# EasyEDA Pro project Sch1.epro

# Schematic Schematic1

## Sheets
1 01-POWER
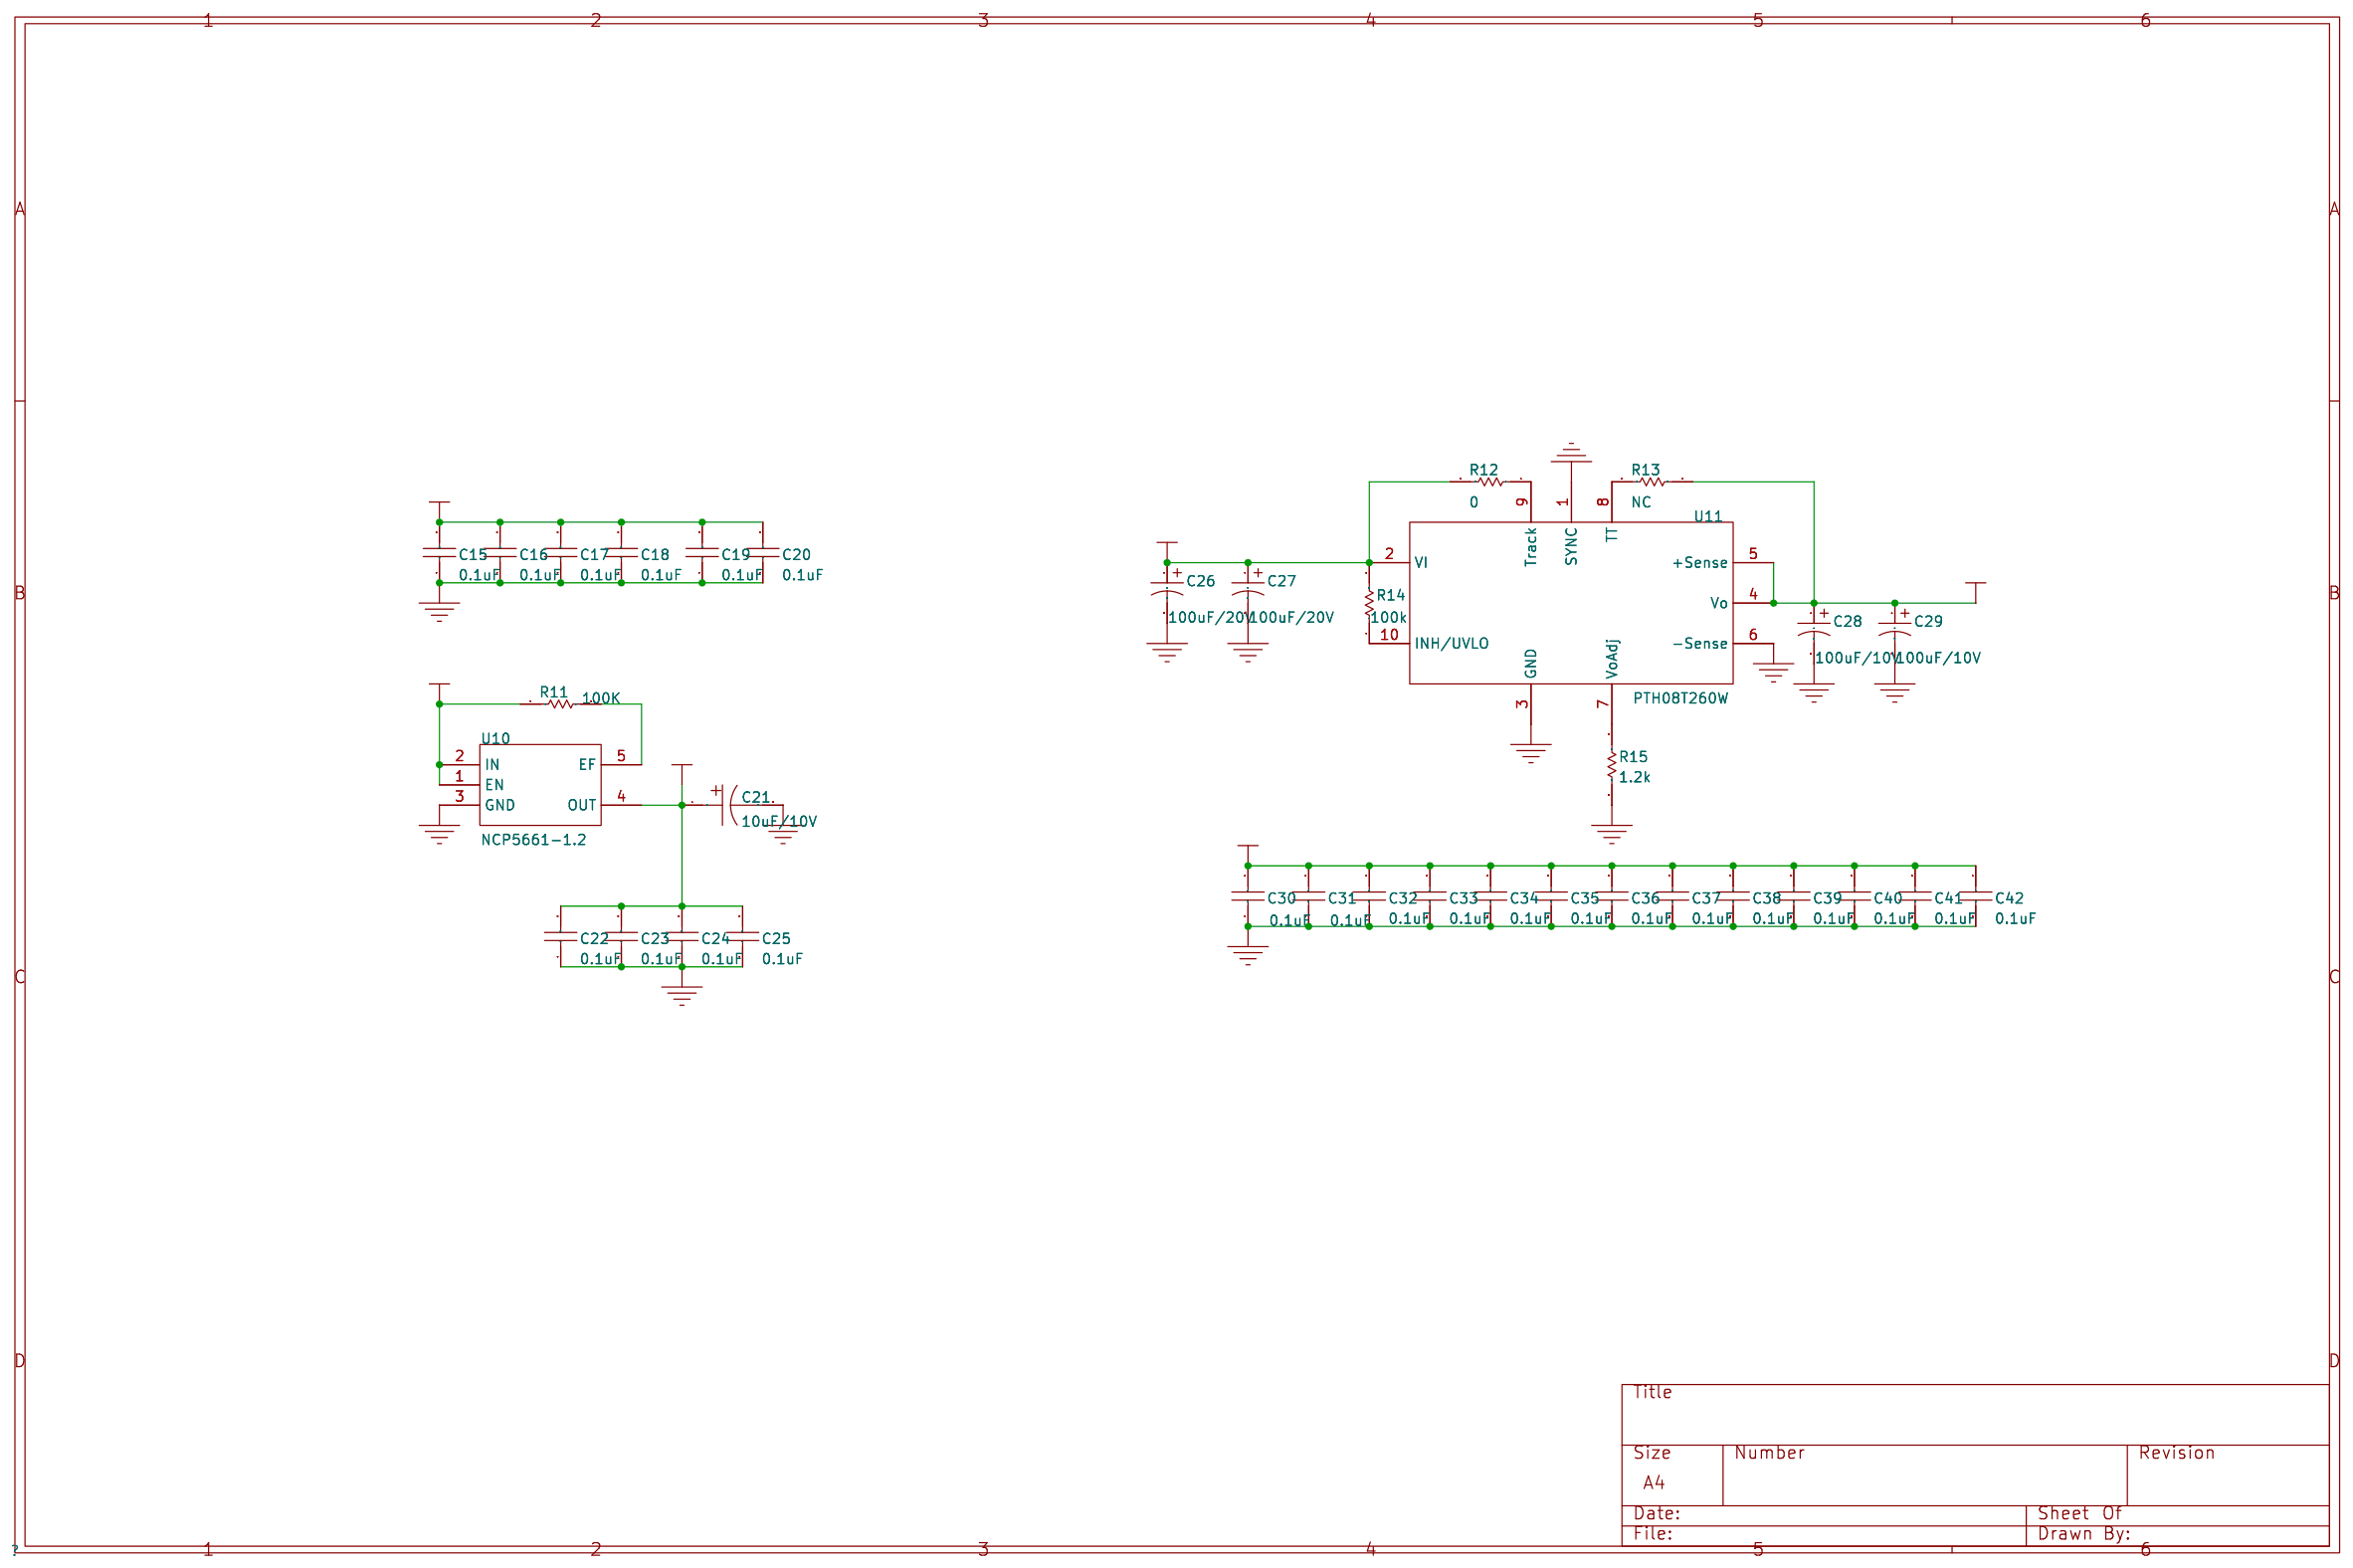
[diagram p0: 01-POWER]
2 02-FPGA
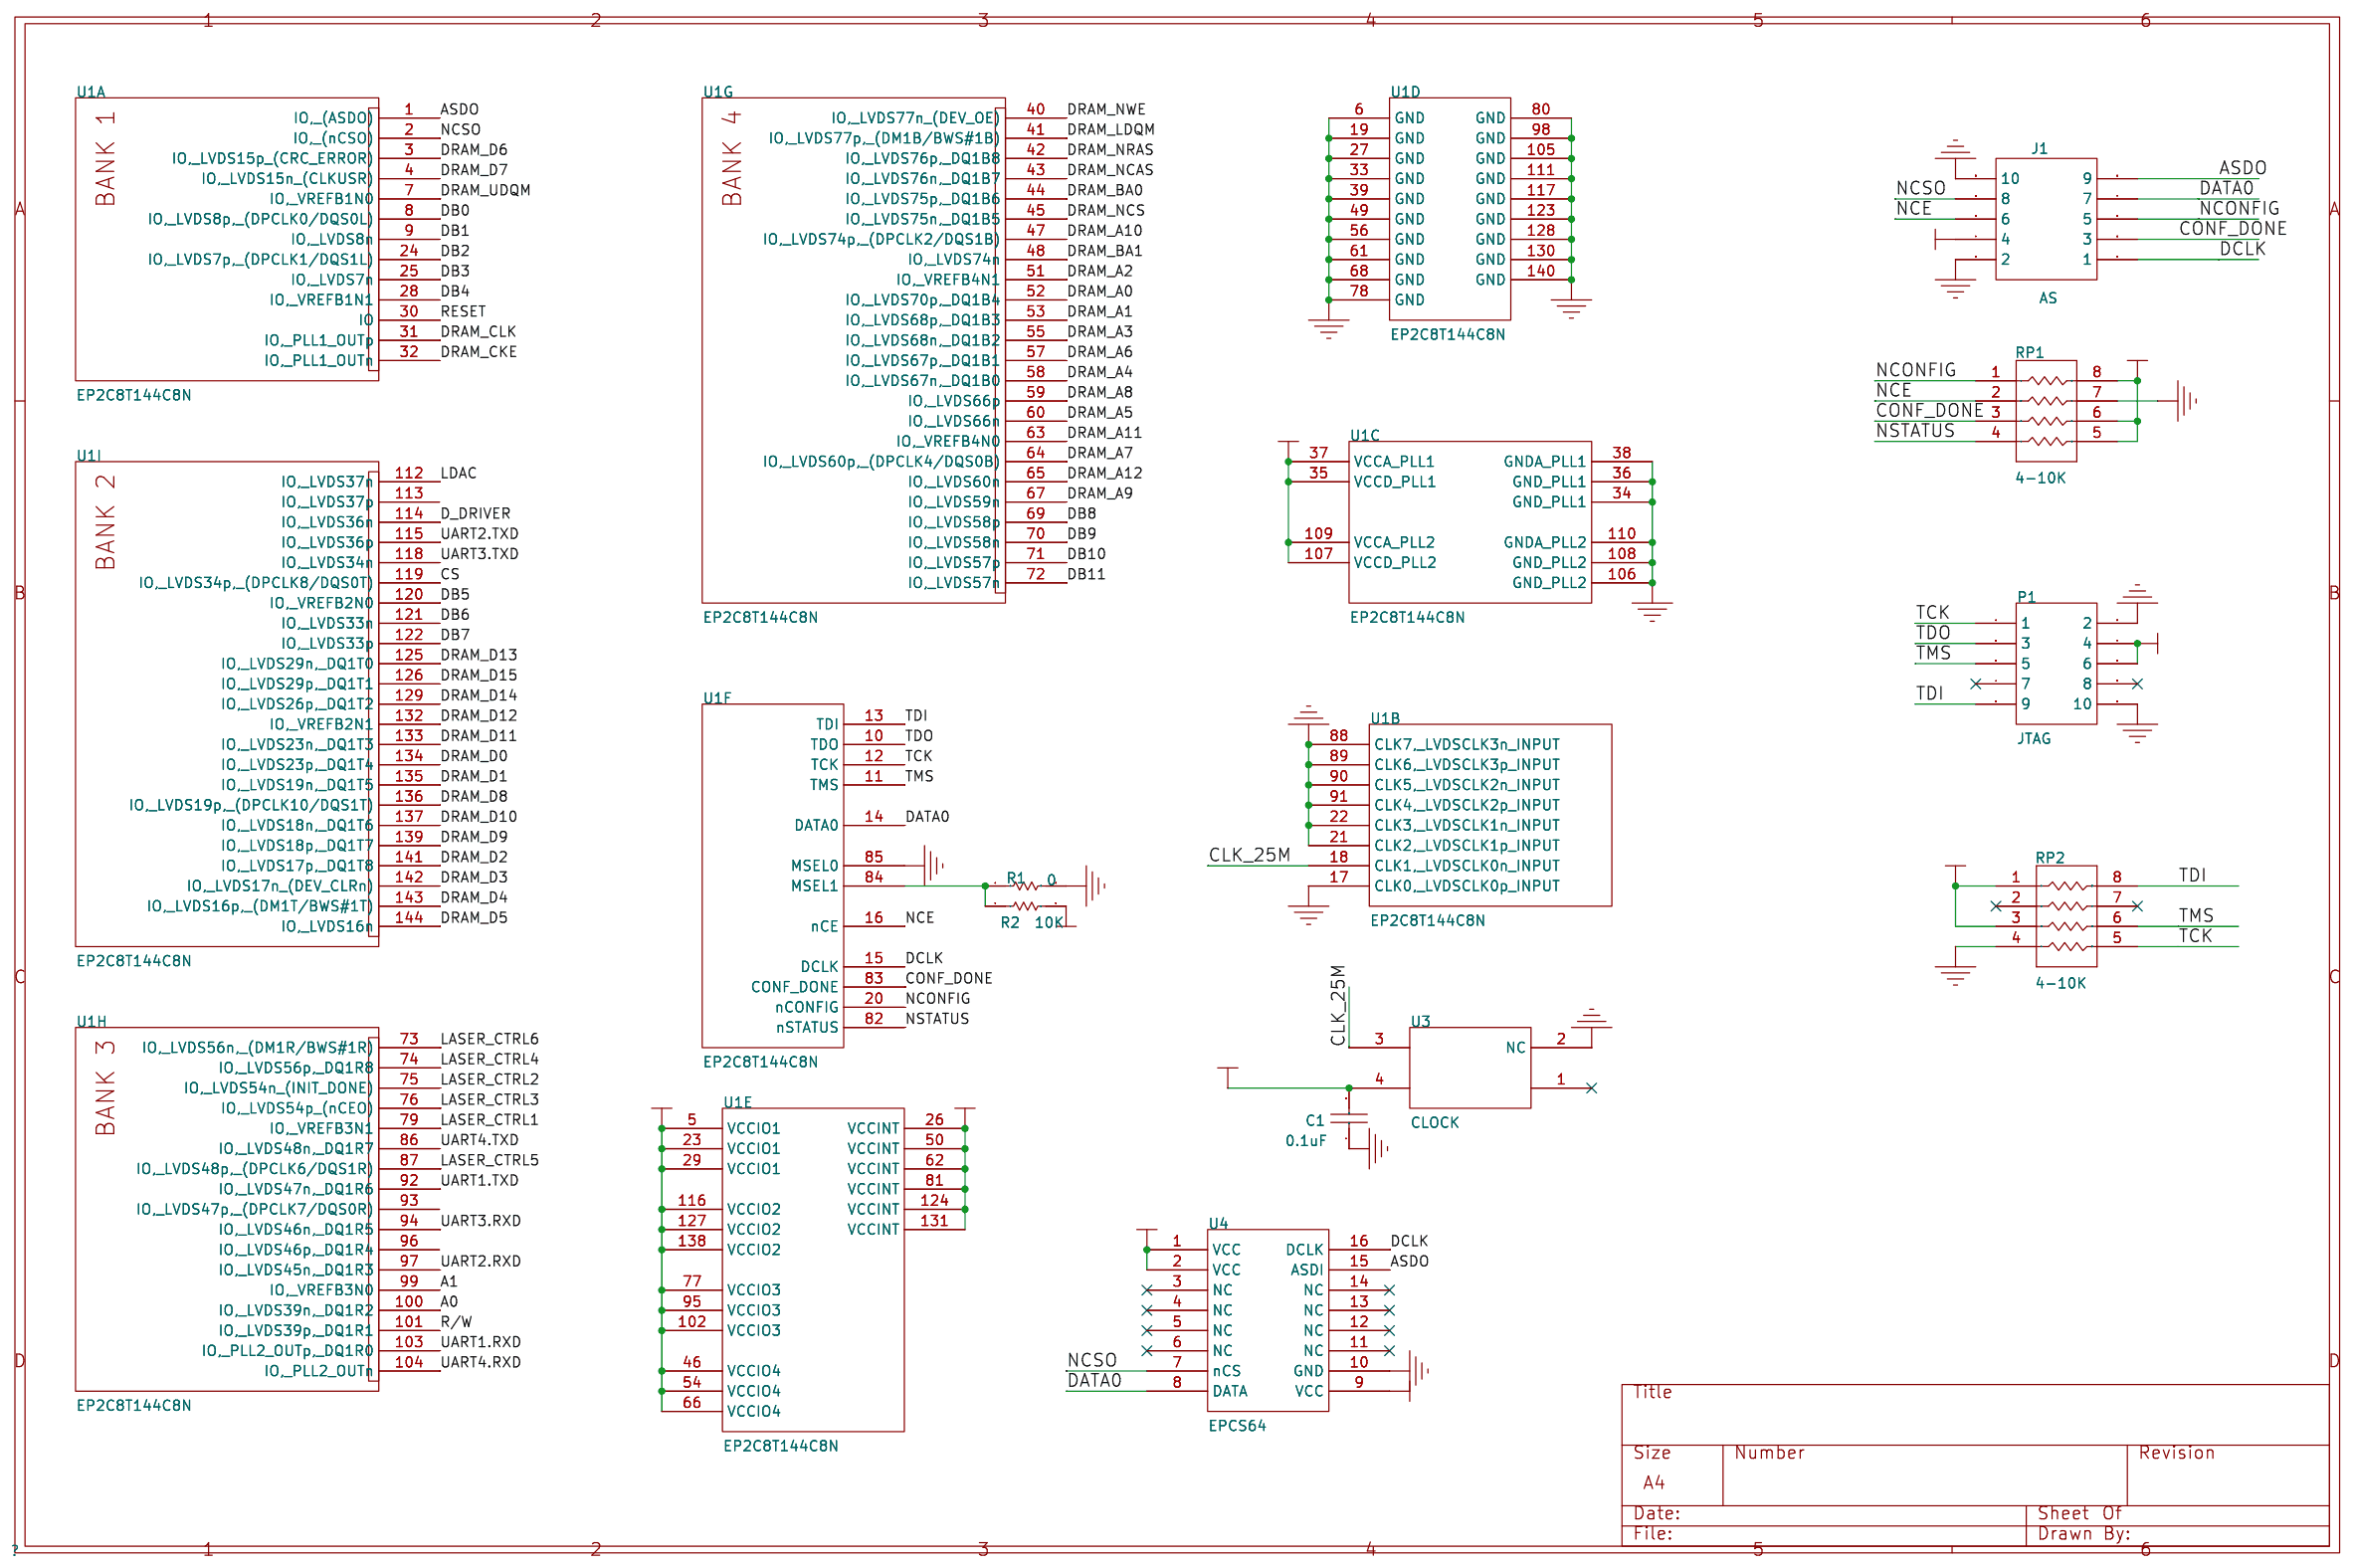
[diagram p1: 02-FPGA]
3 03-MEMORY
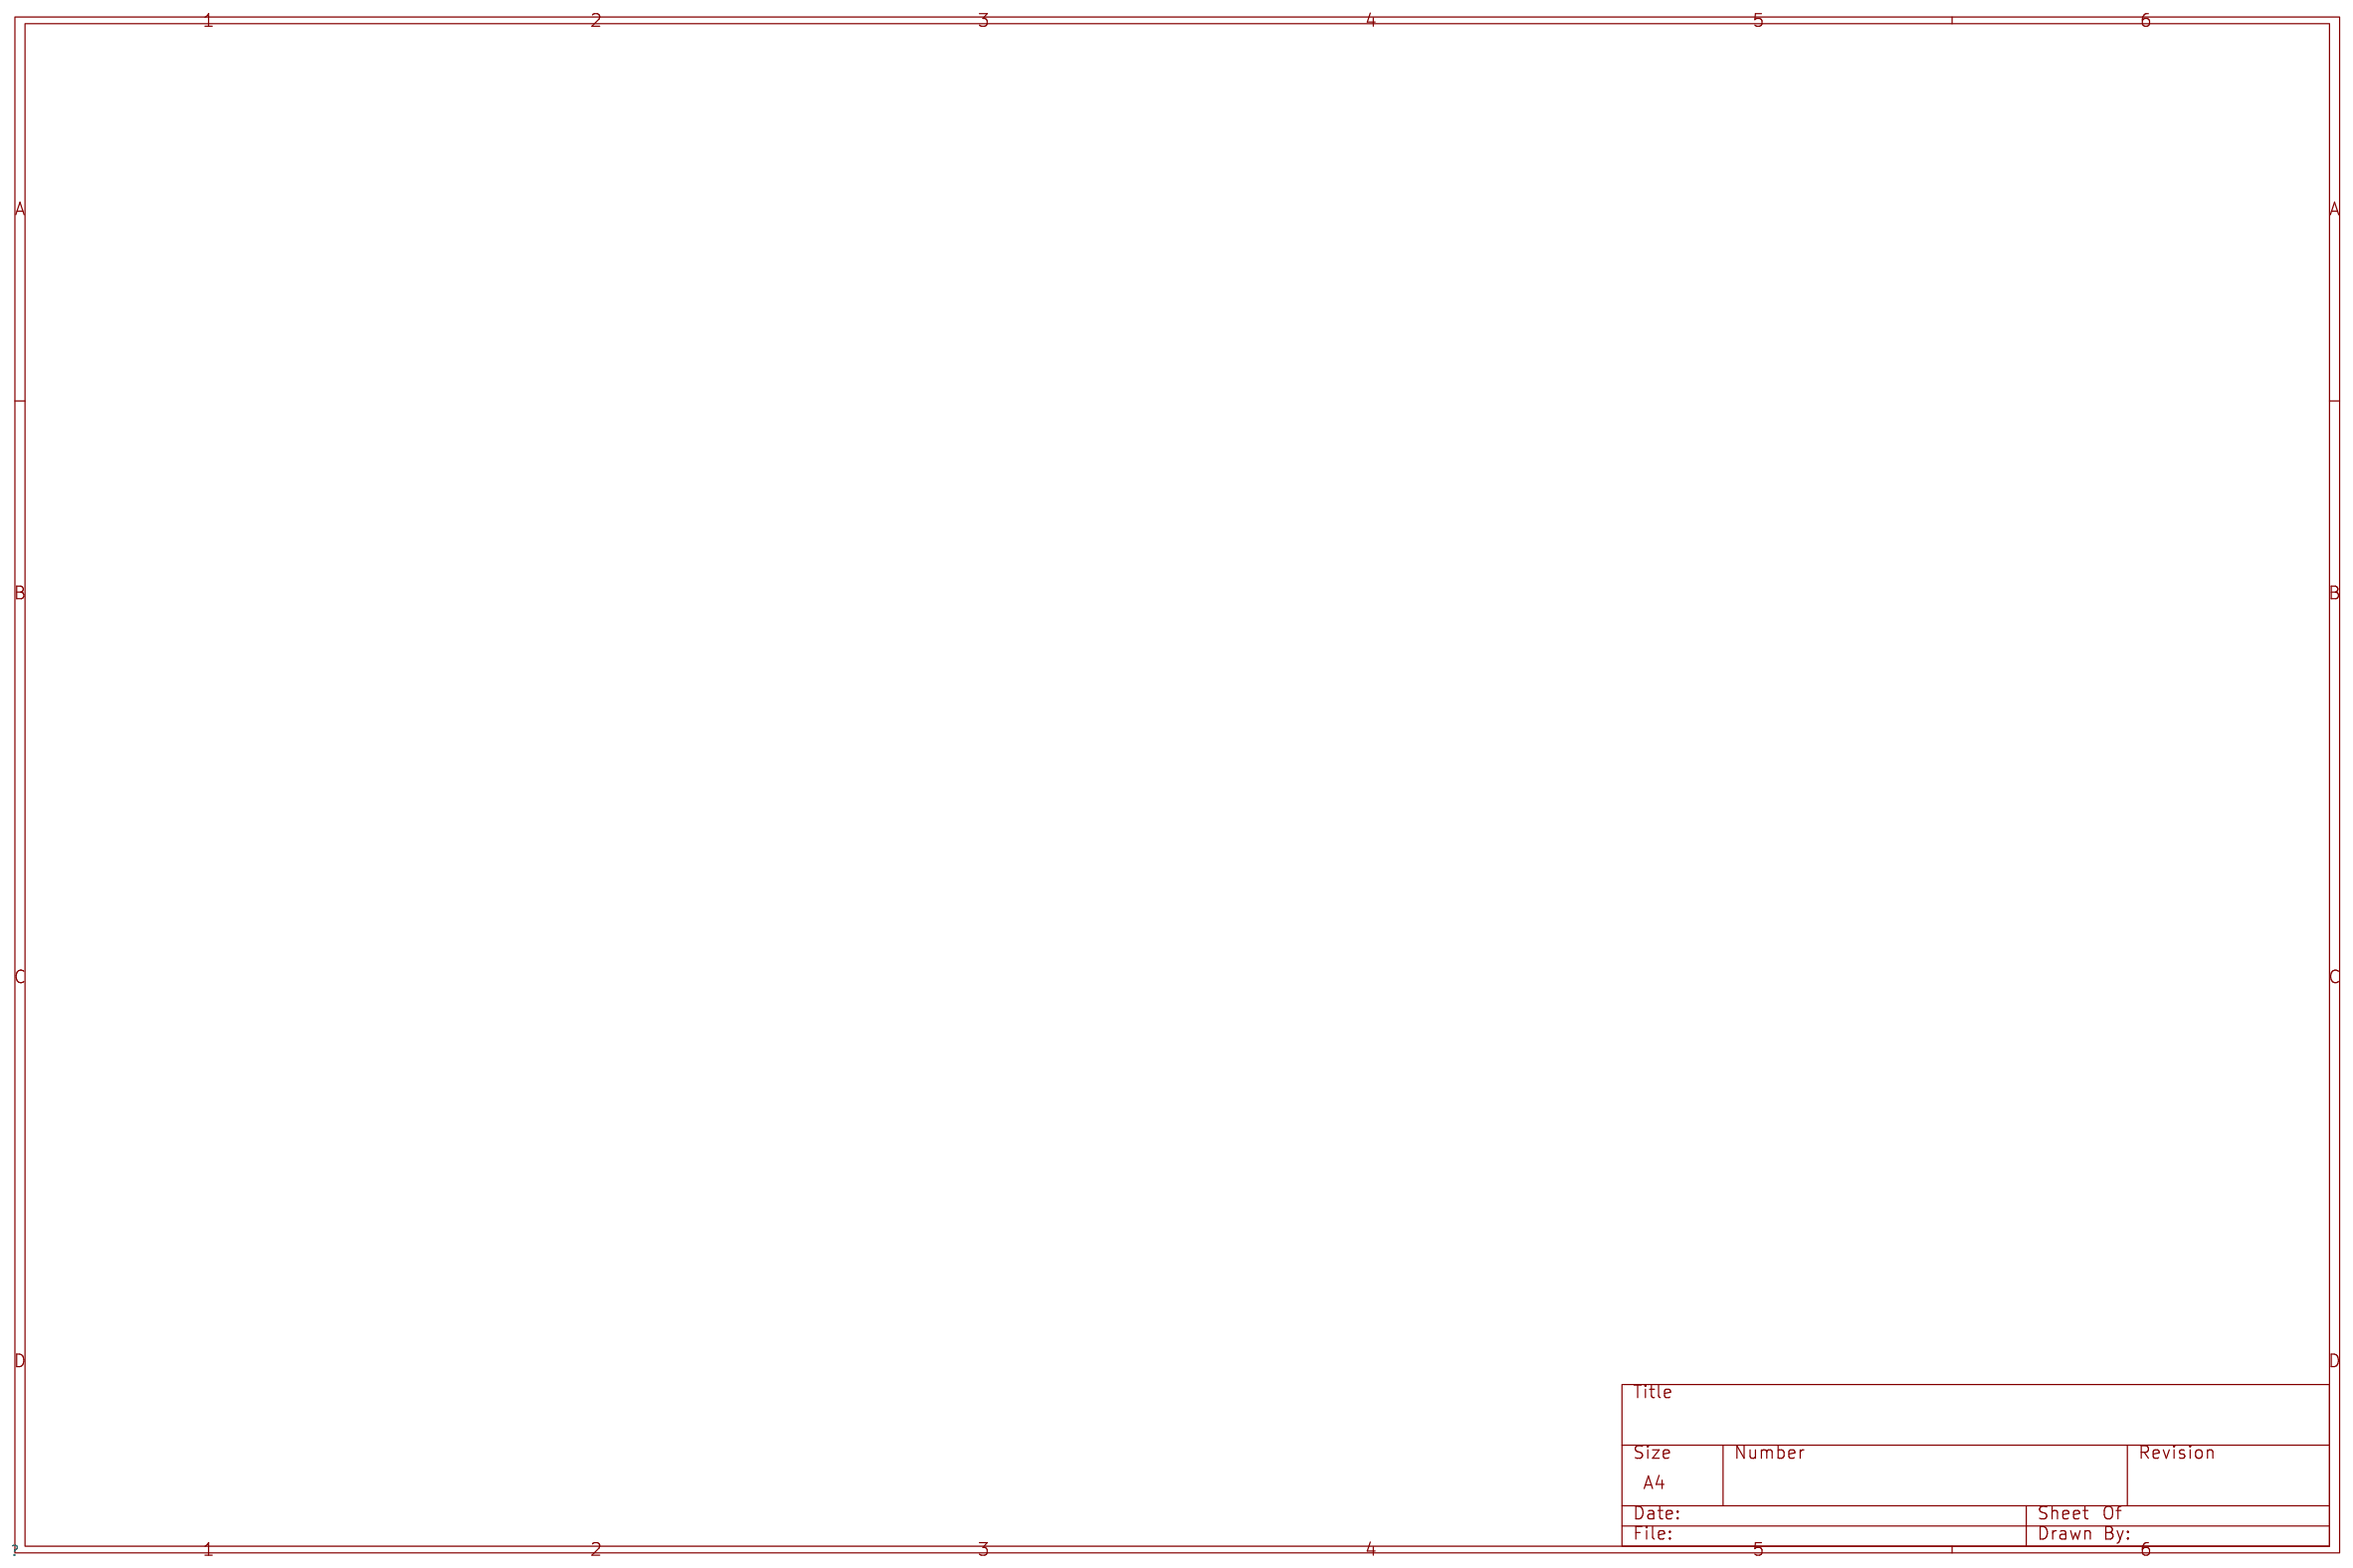
[diagram p2: 03-MEMORY]
4 04-RS422-2
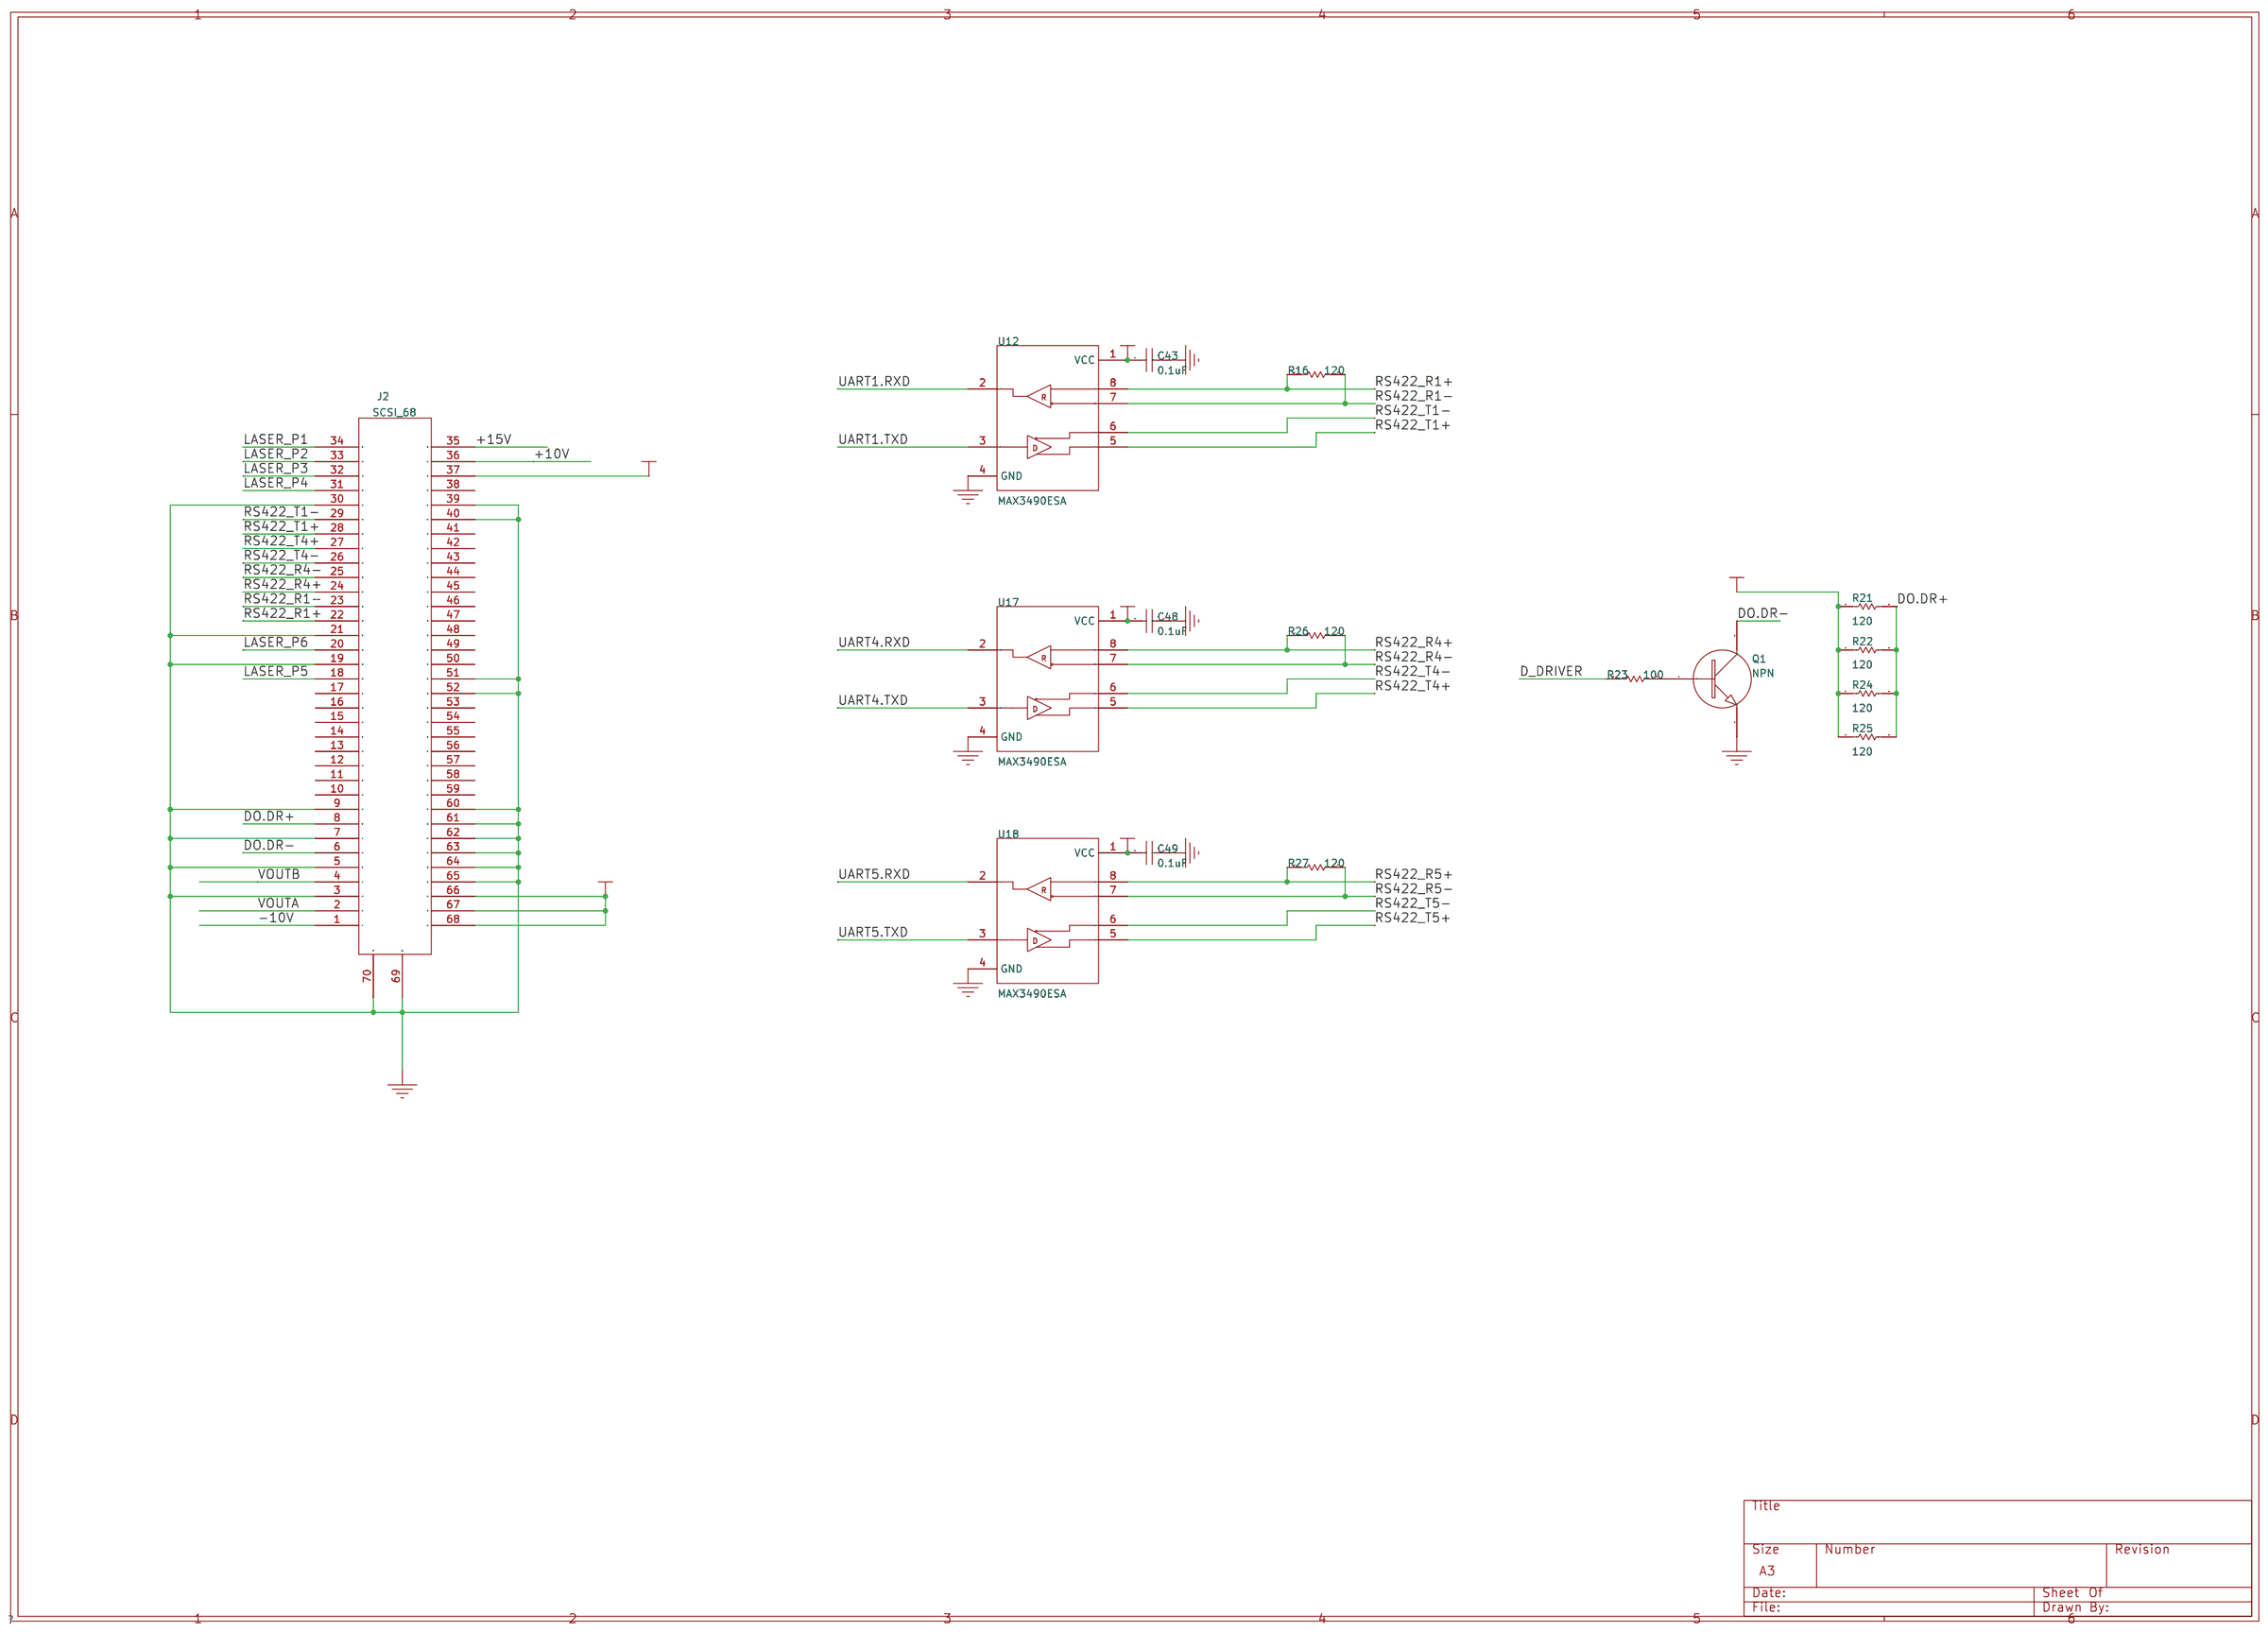
[diagram p3: 04-RS422-2]
5 05-AD8412
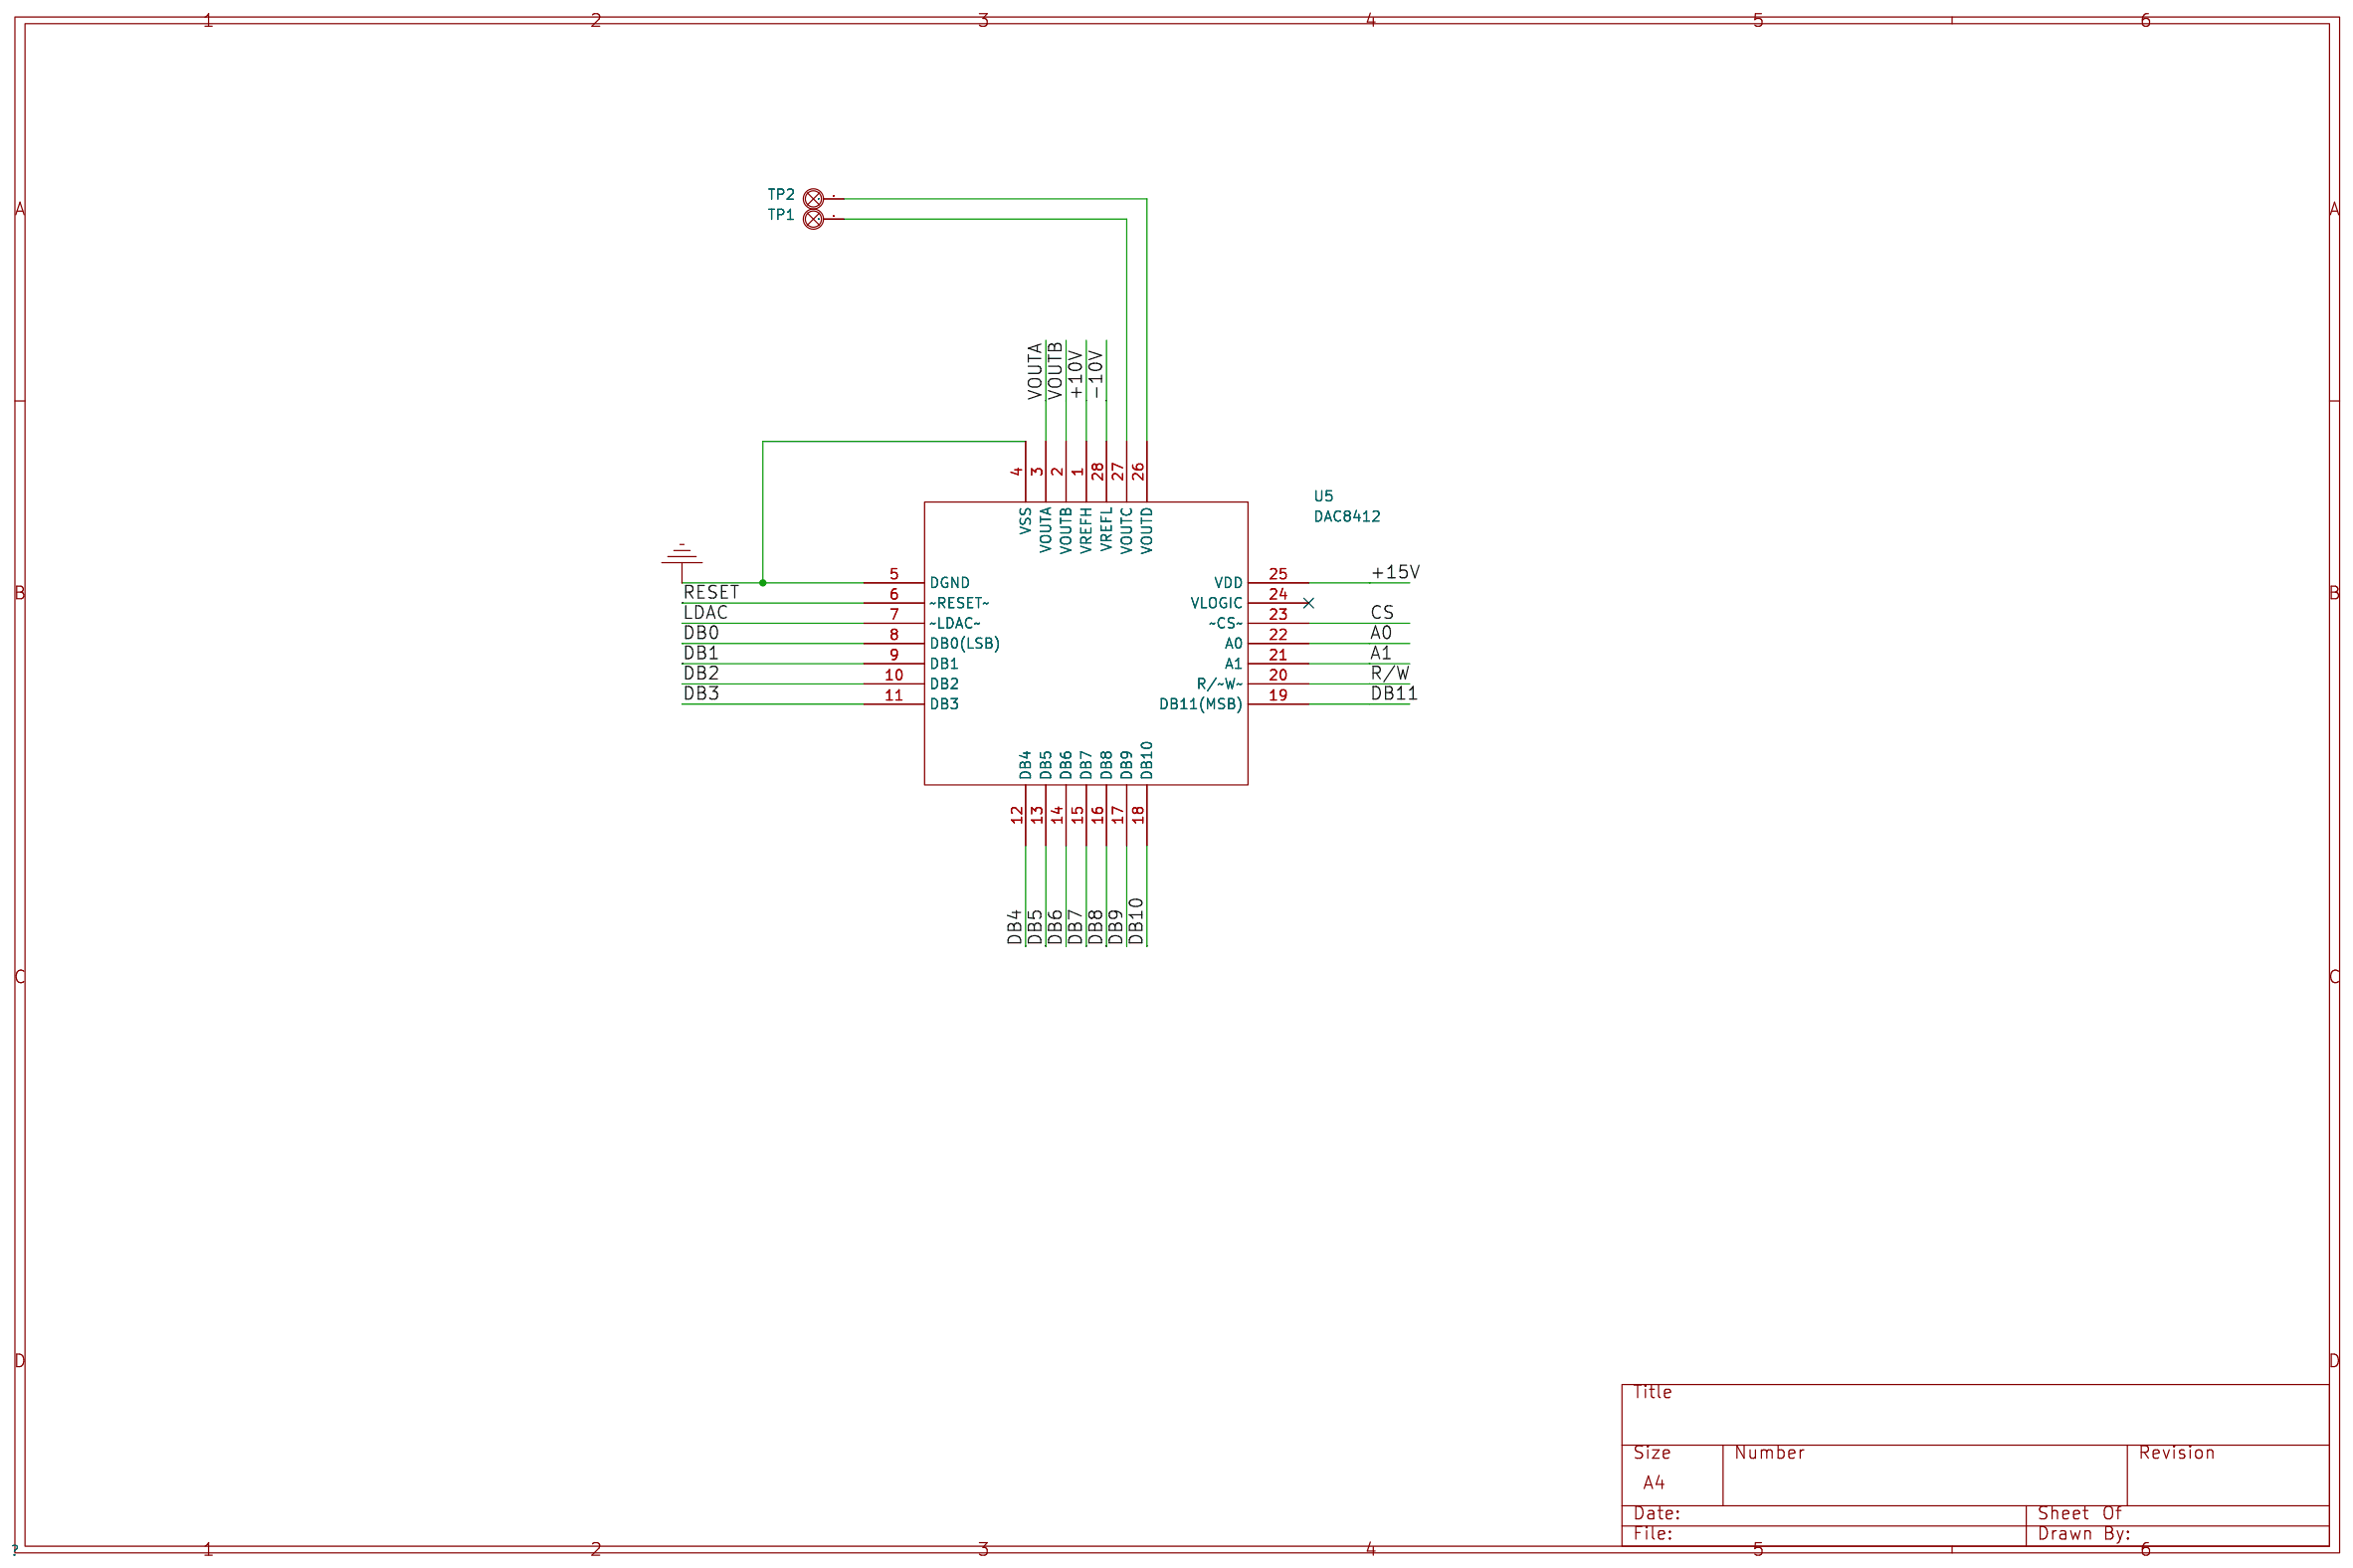
[diagram p4: 05-AD8412]
6 06-LASERCONTROL
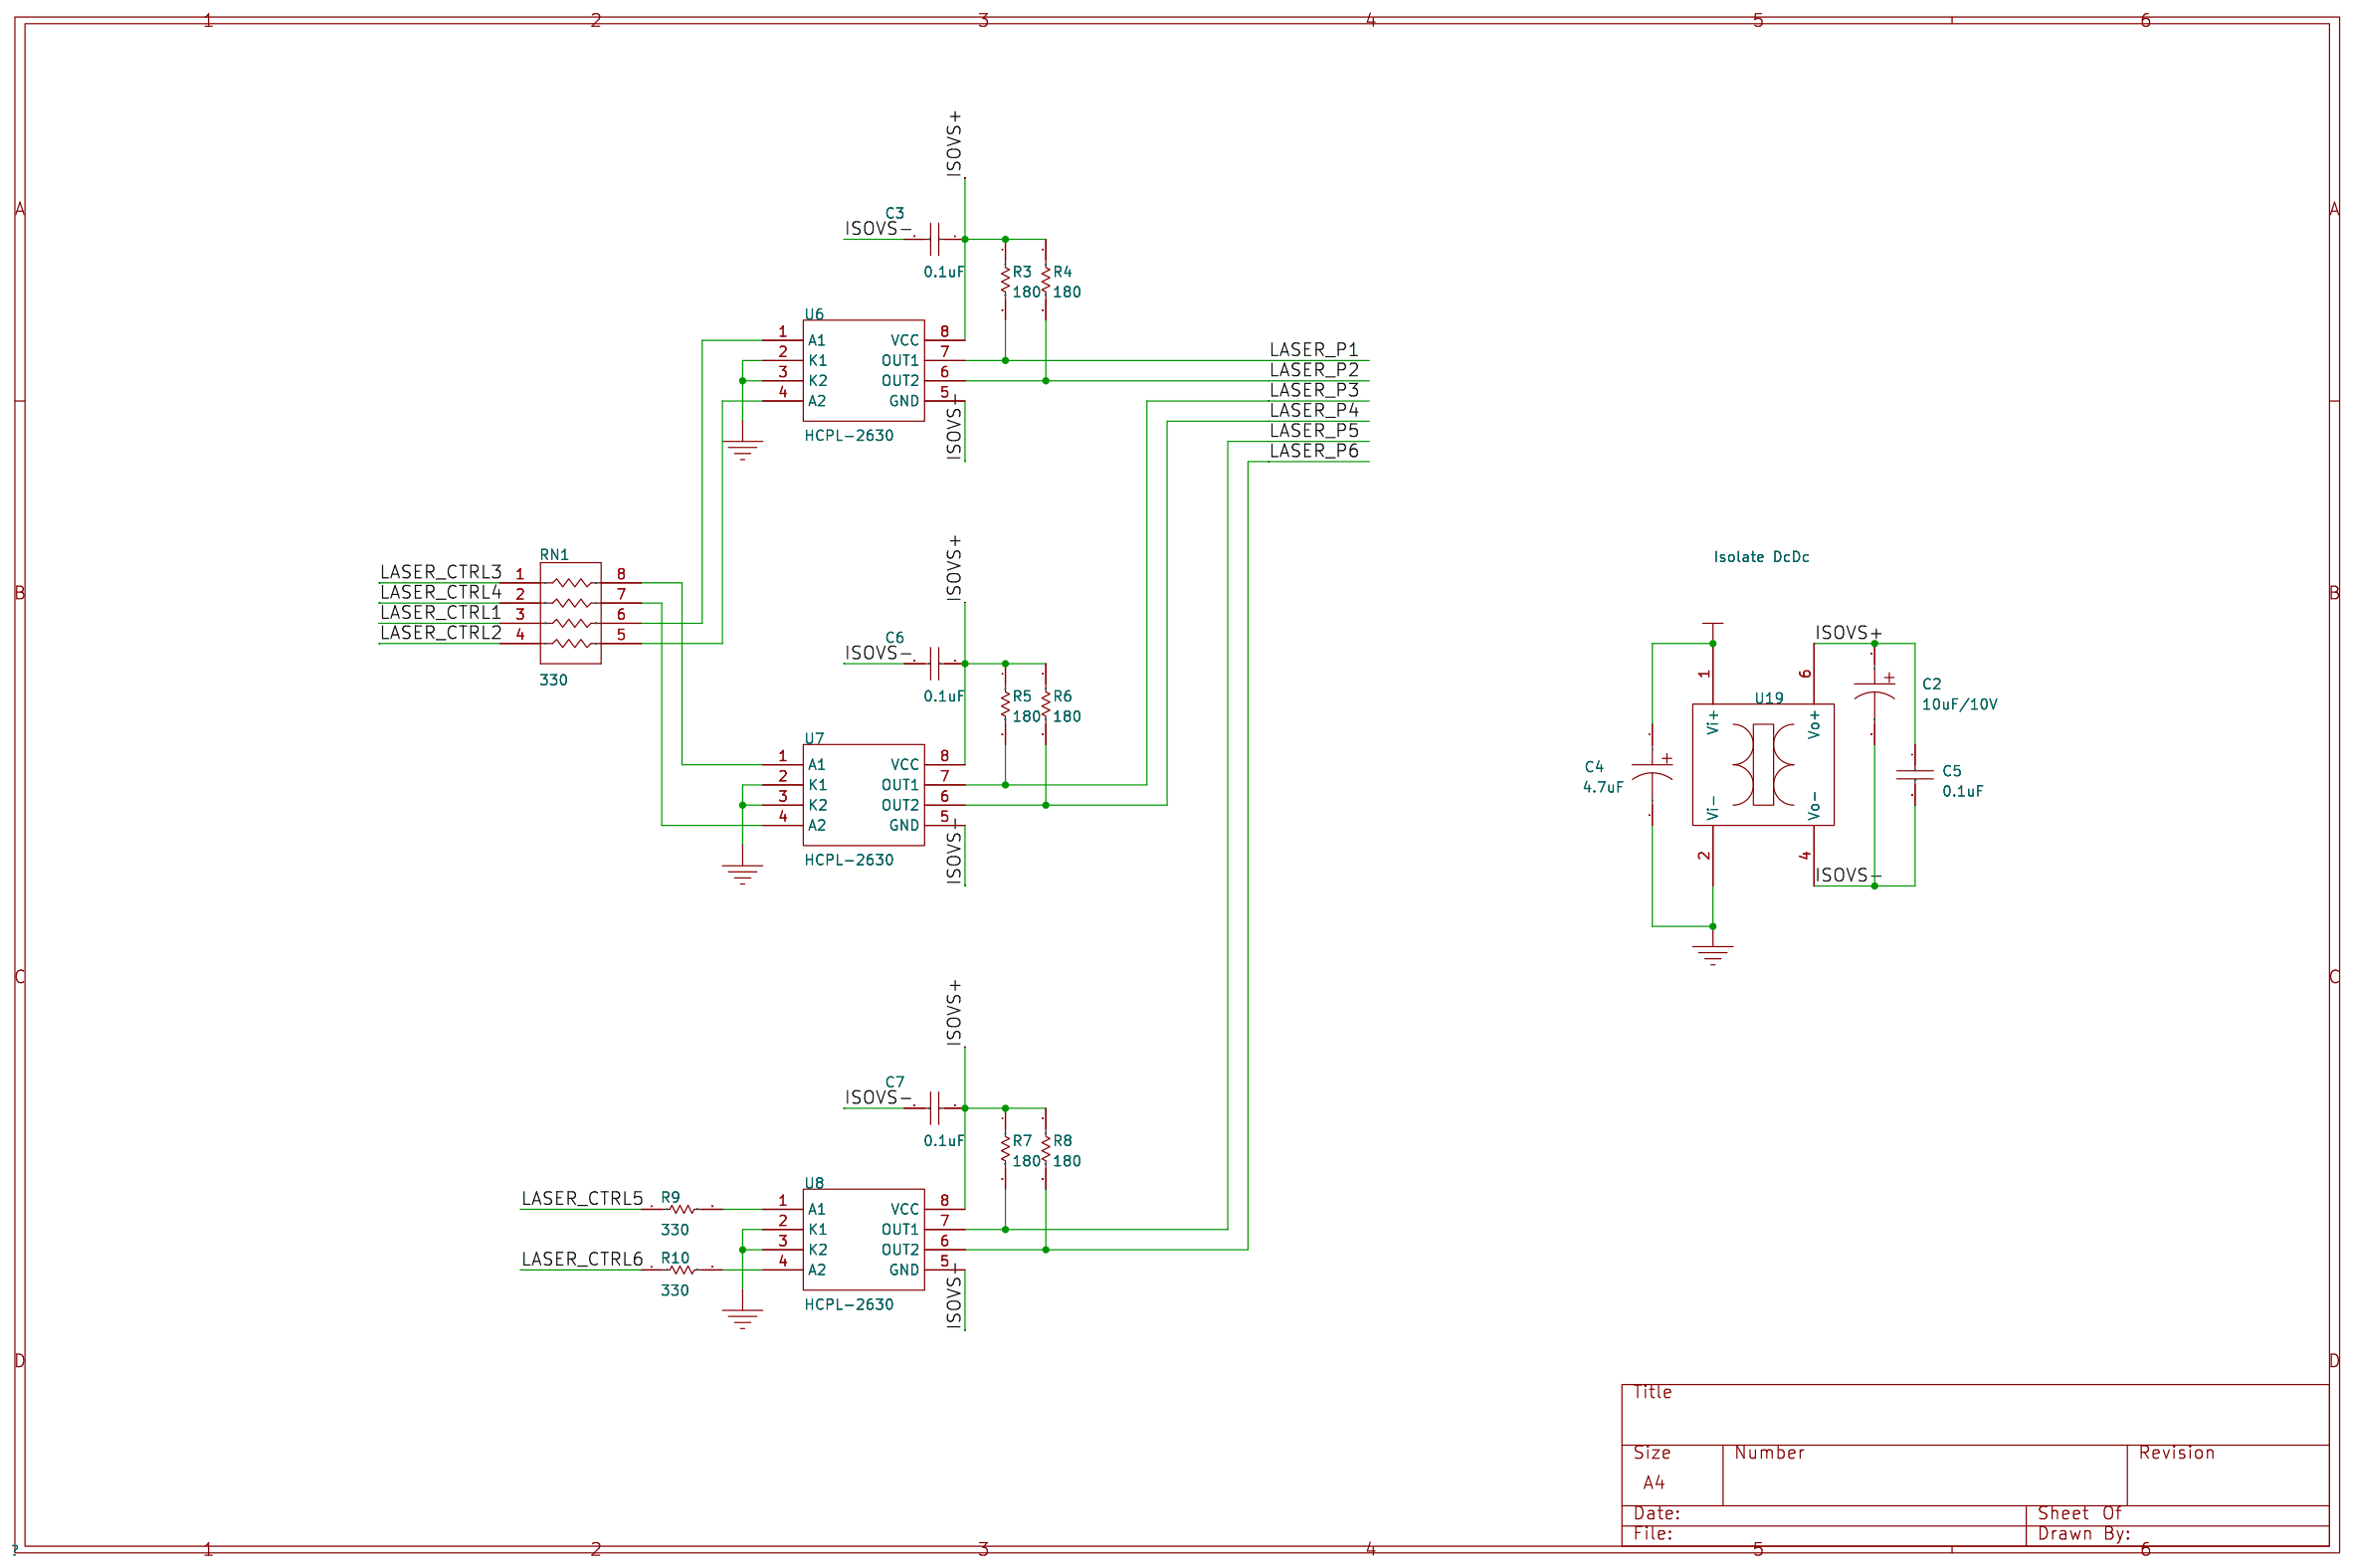
[diagram p5: 06-LASERCONTROL]

## Parts
sheet 01-POWER
C15  0.1uF  [0805-X]
C16  100pF  [0805-X]
C17  100pF  [0805-X]
C18  100pF  [0805-X]
C19  100pF  [0805-X]
C20  100pF  [0805-X]
C21  10uF/10V  [CC3225-1210]
C22  0.1uF  [0805-X]
C23  0.1uF  [0805-X]
C24  0.1uF  [0805-X]
C25  0.1uF  [0805-X]
C26  100uF/20V  [CC7343]
C27  100uF/20V  [CC7343]
C28  100uF/10V  [CC7343]
C29  100uF/10V  [CC7343]
C30  0.1uF  [0805-X]
C31  0.1uF  [0805-X]
C32  0.1uF  [0805-X]
C33  0.1uF  [0805-X]
C34  0.1uF  [0805-X]
C35  0.1uF  [0805-X]
C36  0.1uF  [0805-X]
C37  0.1uF  [0805-X]
C38  0.1uF  [0805-X]
C39  0.1uF  [0805-X]
C40  0.1uF  [0805-X]
C41  0.1uF  [0805-X]
C42  0.1uF  [0805-X]
R11  100K  [CR2012-0805]
R12  0  [CR3216-1206]
R13  NC  [CR3216-1206]
R14  100k  [CR3216-1206]
R15  1.2k  [CR3216-1206]
U10  NCP5661-1.2  [DPAK5]
U11  PTH08T260W  [TI_R-PDSS-T10]
sheet 02-FPGA
C1  0.1uF  [0805-X]
J1  AS  [HDR2X5]
P1  JTAG  [HDR2X5]
R1  0  [CR2012-0805]
R2  10K  [CR2012-0805]
RP1  4-10K  [CRP4.1608]
RP2  4-10K  [CRP4.1608]
U1  EP2C8T144C8N  [F-QFP20X20-G144/N]  (sections 1,2,3,4,5,6,7,8,9)
U3  CLOCK  [SMX_20MH]
U4  EPCS64  [SO-G16/E6.9]
sheet 04-RS422-2
C43  0.1uF  [0805-X]
C48  0.1uF  [0805-X]
C49  0.1uF  [0805-X]
J2  SCSI_68  [SCSI68]
Q1  NPN  [3DG130BJ_NPN]
R16  120  [CR3216-1206]
R21  120  [CR3216-1206]
R22  120  [CR3216-1206]
R23  100  [CR3216-1206]
R24  120  [CR3216-1206]
R25  120  [CR3216-1206]
R26  120  [CR3216-1206]
R27  120  [CR3216-1206]
U12  MAX3490ESA  [SO8.W=6.0]
U17  MAX3490ESA  [SO8.W=6.0]
U18  MAX3490ESA  [SO8.W=6.0]
sheet 05-AD8412
TP1  TESTPOINT  [TP24-SMD]
TP2  TESTPOINT  [TP24-SMD]
U5  DAC8412
sheet 06-LASERCONTROL
C2  10uF/10V  [CC3225-1210]
C3  100pF  [0805-X]
C4  4.7uF  [CC3225-1210]
C5  0.1uF  [0805-X]
C6  100pF  [0805-X]
C7  100pF  [0805-X]
R3  1K  [CR3216-1206]
R4  1K  [CR3216-1206]
R5  1K  [CR3216-1206]
R6  1K  [CR3216-1206]
R7  1K  [CR3216-1206]
R8  1K  [CR3216-1206]
R9  1K  [CR3216-1206]
R10  1K  [CR3216-1206]
RN1  330  [CRP4.1608]
U6  HCPL-2630  [SO-G8/Z10.8]
U7  HCPL-2630  [SO-G8/Z10.8]
U8  HCPL-2630  [SO-G8/Z10.8]
U19  Isolate DcDc  [IB0505LS]

## Library data of the parts
C15 = 0.1uF: Capacitor; Published: 8-Jun-2000; LatestRevisionDate: 17-Jul-2002; LatestRevisionNote: Re-released for DXP Platform.; PackageReference: RAD-0.3; Publisher: Altium Limited; Origin Footprint 2: CC2012-0805; Origin Footprint 3: VP32-3.2; Origin Footprint 4: VP45-3.2; Origin Footprint 5: 0603R; Origin Footprint 6: CR2012-0805; Design Item ID: Cap; Library Name: *
C16-C20 = 0.1uF: Capacitor; Published: 8-Jun-2000; LatestRevisionDate: 17-Jul-2002; LatestRevisionNote: Re-released for DXP Platform.; PackageReference: RAD-0.3; Publisher: Altium Limited; Origin Footprint 2: CC2012-0805; Origin Footprint 3: VP32-3.2; Origin Footprint 4: VP45-3.2; Origin Footprint 5: CR2012-0805; Origin Footprint 6: CR2012-0805; Design Item ID: Cap; Library Name: *
C2 C21 = 10uF/10V: Capacitor; Design Item ID: CAPACITOR POL; Library Name: *
C22-C25 C30-C42 = 0.1uF: Capacitor (Semiconductor SIM Model); Published: 8-Jun-2000; LatestRevisionDate: 17-Jul-2002; LatestRevisionNote: Re-released for DXP Platform.; PackageReference: C1206; Publisher: Altium Limited; Origin Footprint 2: C1206; Origin Footprint 3: 0402; Origin Footprint 4: 1310[0504]; Origin Footprint 5: 1608[0603]; Origin Footprint 6: C1210; Origin Footprint 7: CR2012-0805; Design Item ID: Cap Semi; Library Name: Miscellaneous Devices
C26 C27 = 100uF/20V: 钽电容,25V; Published: 8-Jun-2000; LatestRevisionDate: 17-Jul-2002; LatestRevisionNote: Re-released for DXP Platform.; PackageReference: RB7.6-15; Publisher: Altium Limited; Origin Footprint 2: HA-C1; Origin Footprint 3: A; Origin Footprint 4: B; Origin Footprint 5: CAPPR5-5x5; Origin Footprint 6: CAPPR7.5-16x35; Design Item ID: Cap Pol1; Library Name: Miscellaneous Devices
C28 C29 = 100uF/10V: 10V, X7R; Published: 8-Jun-2000; LatestRevisionDate: 17-Jul-2002; LatestRevisionNote: Re-released for DXP Platform.; PackageReference: RB7.6-15; Publisher: Altium Limited; Origin Footprint 2: HA-C1; Origin Footprint 3: A; Origin Footprint 4: B; Origin Footprint 5: CAPPR5-5x5; Origin Footprint 6: CAPPR7.5-16x35; Design Item ID: Cap Pol1; Library Name: Miscellaneous Devices
R11 = 100K: Semiconductor Resistor; Published: 8-Jun-2000; LatestRevisionDate: 17-Jul-2002; LatestRevisionNote: Re-released for DXP Platform.; PackageReference: AXIAL-0.5; Publisher: Altium Limited; Origin Footprint 2: AXIAL-0.5; Origin Footprint 3: 1005[0402]; Origin Footprint 4: 1608[0603]; Origin Footprint 5: 2012[0805]; Origin Footprint 6: 3216[1206]; Origin Footprint 7: 0805-X; Origin Footprint 1: 0805; Design Item ID: Res Semi; Library Name: Miscellaneous Devices
R12 = 0: Resistor; Published: 8-Jun-2000; LatestRevisionDate: 17-Jul-2002; LatestRevisionNote: Re-released for DXP Platform.; PackageReference: AXIAL-0.3; Publisher: Altium Limited; Origin Footprint 2: AXIAL-0.3; Origin Footprint 3: CC0805-1206; Origin Footprint 1: CR2012-0805; Design Item ID: Res1; Library Name: Miscellaneous Devices
R13 = NC: Resistor; Published: 8-Jun-2000; LatestRevisionDate: 17-Jul-2002; LatestRevisionNote: Re-released for DXP Platform.; PackageReference: AXIAL-0.3; Publisher: Altium Limited; Origin Footprint 2: AXIAL-0.3; Origin Footprint 3: CC0805-1206; Origin Footprint 1: CR2012-0805; Design Item ID: Res1; Library Name: Miscellaneous Devices
R14 = 100k: Resistor; Published: 8-Jun-2000; LatestRevisionDate: 17-Jul-2002; LatestRevisionNote: Re-released for DXP Platform.; PackageReference: AXIAL-0.3; Publisher: Altium Limited; Origin Footprint 2: AXIAL-0.3; Origin Footprint 3: CC0805-1206; Origin Footprint 1: CR2012-0805; Design Item ID: Res1; Library Name: Miscellaneous Devices
R15 = 1.2k: Resistor; Published: 8-Jun-2000; LatestRevisionDate: 17-Jul-2002; LatestRevisionNote: Re-released for DXP Platform.; PackageReference: AXIAL-0.3; Publisher: Altium Limited; Origin Footprint 2: AXIAL-0.3; Origin Footprint 3: CC0805-1206; Origin Footprint 1: CR2012-0805; Design Item ID: Res1; Library Name: Miscellaneous Devices
U10 = NCP5661-1.2: Design Item ID: NCP5661; Library Name: *
U11 = PTH08T260W: TI电源模块; Design Item ID: PTH08T230W; Library Name: IC
C1 = 0.1uF: Capacitor; Origin Footprint 2: 1005; Origin Footprint 3: CR2012-0805; Design Item ID: CAP; Library Name: *
J1 = AS: Design Item ID: HEADER 5X2; Library Name: *
P1 = JTAG: Header, 5-Pin, Dual row; LatestRevisionDate: 17-Jul-2002; LatestRevisionNote: Re-released for DXP Platform.; Publisher: Altium Limited; Origin Footprint 2: HDR2X5.FRAME; Design Item ID: Header 5X2; Library Name: Miscellaneous Connectors
R1 = 0: Semiconductor Resistor; Published: 8-Jun-2000; LatestRevisionDate: 17-Jul-2002; LatestRevisionNote: Re-released for DXP Platform.; PackageReference: AXIAL-0.5; Publisher: Altium Limited; Origin Footprint 2: AXIAL-0.5; Origin Footprint 3: 1005[0402]; Origin Footprint 4: 1608[0603]; Origin Footprint 5: 2012[0805]; Origin Footprint 6: 3216[1206]; Origin Footprint 1: 0805-X; Design Item ID: Res Semi; Library Name: Miscellaneous Devices
R2 = 10K: Semiconductor Resistor; Published: 8-Jun-2000; LatestRevisionDate: 17-Jul-2002; LatestRevisionNote: Re-released for DXP Platform.; PackageReference: AXIAL-0.5; Publisher: Altium Limited; Origin Footprint 2: AXIAL-0.5; Origin Footprint 3: 1005[0402]; Origin Footprint 4: 1608[0603]; Origin Footprint 5: 2012[0805]; Origin Footprint 6: 3216[1206]; Origin Footprint 1: 0805-X; Design Item ID: Res Semi; Library Name: Miscellaneous Devices
RP1 RP2 = 4-10K: Origin Footprint 2: SOP8; Design Item ID: RES-4; Library Name: *
U1 = EP2C8T144C8N: Cyclone II Family, 1.2V FPGA, 85 I/O Pins, 2 PLLs, 144-Pin TQFP, Speed Grade 8, Commercial Grade, Pb-Free; Published: 4-Mar-2005; LatestRevisionDate: 14-May-2007; LatestRevisionNote: DATA0 pin is now INPUT.; DatasheetVersion: ver3.2, Apr-2007; PackageVersion: ver14.6, Feb-2007; PackageReference: TQFP144; Publisher: Altium Limited; PackageDescription: 144-Pin Plastic Thin Quad Flat Pack (TQFP144) - Wire Bond; Code_JEDEC: MS-026-BFB; ComponentLink1Description: Manufacturer Link; ComponentLink1URL: http://www.altera.com/products/devices/cyclone2/cy2-index.jsp; ComponentLink2Description: Handbook; ComponentLink2URL: http://www.altera.com/literature/hb/cyc2/cyc2_cii5v1.pdf; ComponentLink3Description: Packaging Specification; ComponentLink3URL: http://www.altera.com/literature/ds/dspkg.pdf; Origin Footprint 2: TQFP144_N; Origin Footprint 3: TQFP144_L; Origin Footprint 4: TQFP144_M; Library Name: Altera Cyclone II
U3 = CLOCK: CLOCK: *; Origin Footprint 2: XTAL_4M; Library Name: *
U4 = EPCS64: EPCS16 64 128; Library Name: IC
C43 C48 C49 = 0.1uF: X7R; Published: 8-Jun-2000; LatestRevisionDate: 17-Jul-2002; LatestRevisionNote: Re-released for DXP Platform.; PackageReference: RAD-0.3; Publisher: Altium Limited; Origin Footprint 2: CC2012-0805; Origin Footprint 3: VP32-3.2; Origin Footprint 4: VP45-3.2; Origin Footprint 5: CC2012-0603; Origin Footprint 6: CR2012-0805; Origin Footprint 1: CR1608-0603; Design Item ID: Cap; Library Name: Miscellaneous Devices
J2 = SCSI_68: Design Item ID: SCS; Library Name: 原理图库
Q1 = NPN: NPN Transistor; Library Name: RS232Ctrl_Int
R16 R21 R22 R24-R27 = 120: Resistor; Published: 8-Jun-2000; LatestRevisionDate: 17-Jul-2002; LatestRevisionNote: Re-released for DXP Platform.; PackageReference: AXIAL-0.3; Publisher: Altium Limited; Origin Footprint 2: AXIAL-0.3; Origin Footprint 3: CC0805-1206; Origin Footprint 4: CR2012-0805; Origin Footprint 5: 1608[0603]; Origin Footprint 6: 0805-X; Origin Footprint 7: 0805; Design Item ID: Res1; Library Name: Miscellaneous Devices
R23 = 100: Resistor; Published: 8-Jun-2000; LatestRevisionDate: 17-Jul-2002; LatestRevisionNote: Re-released for DXP Platform.; PackageReference: AXIAL-0.3; Publisher: Altium Limited; Origin Footprint 2: AXIAL-0.3; Origin Footprint 3: CC0805-1206; Origin Footprint 4: CR2012-0805; Origin Footprint 5: 1608[0603]; Origin Footprint 6: 0805; Origin Footprint 1: 0805-X; Design Item ID: Res1; Library Name: Miscellaneous Devices
U12 U17 U18 = MAX3490ESA: Low-Power, Slew-Rate-Limited RS-485/RS-422 Transceiver; Published: 16-Jan-2001; LatestRevisionDate: 13-Apr-2006; LatestRevisionNote: IPC-7351 Footprint Added.; DatasheetVersion: Feb-1996; PackageReference: NSO8; Publisher: Altium Limited; PackageDescription: 8-Pin Small Outline Integrated Circuit 1.27 mm Pitch; Code_JEDEC: MS-012-AA; Code_IPC: SOIC127P600-8; ComponentLink1Description: Manufacturer Link; ComponentLink1URL: http://www.maxim-ic.com/; ComponentLink2Description: Datasheet; ComponentLink2URL: http://pdfserv.maxim-ic.com/en/ds/MAX1487-MAX491.pdf; Origin Footprint 2: NSO8_N; Origin Footprint 3: NSO8_L; Design Item ID: MAX488ESA; Library Name: Maxim Communication Transceiver
TP1 TP2 = TESTPOINT: PARTS: 1; LEVEL: STD; OriginalSymbolOrigin: (20,20); Design Item ID: TESTPOINT_0; Library Name: *
U5 = DAC8412: Library Name: sucaiku
C3 C6 C7 = 0.1uF: Capacitor; Published: 8-Jun-2000; LatestRevisionDate: 17-Jul-2002; LatestRevisionNote: Re-released for DXP Platform.; PackageReference: RAD-0.3; Publisher: Altium Limited; Origin Footprint 2: VP32-3.2; Origin Footprint 3: VP45-3.2; Origin Footprint 4: VP45-3.2; Origin Footprint 5: 0603R; Origin Footprint 6: CR2012-0805; Origin Footprint 1: CC2012-0805; Design Item ID: Cap; Library Name: *
C4 = 4.7uF: Capacitor; Design Item ID: CAPACITOR POL; Library Name: *
C5 = 0.1uF: Capacitor; Design Item ID: CAP; Library Name: *
R3-R8 = 180: Resistor; Published: 8-Jun-2000; LatestRevisionDate: 17-Jul-2002; LatestRevisionNote: Re-released for DXP Platform.; PackageReference: AXIAL-0.3; Publisher: Altium Limited; Origin Footprint 1: CR2012-0805; Design Item ID: Res1; Library Name: *
R9 R10 = 330: Resistor; Published: 8-Jun-2000; LatestRevisionDate: 17-Jul-2002; LatestRevisionNote: Re-released for DXP Platform.; PackageReference: AXIAL-0.3; Publisher: Altium Limited; Origin Footprint 3: CR2012-0805; Origin Footprint 1: 0805; Design Item ID: Res1; Library Name: *
RN1 = 330: Resistor Array,include 4 resistor in one chip; Design Item ID: RN4; Library Name: 电子元器件
U6-U8 = HCPL-2630: Library Name: *
U19 = Isolate DcDc: Design Item ID: MY_I_DC_DC; Library Name: *

## Nets
+10V: J2.36 U5.1(VREFH)
+15V: J2.35 U5.25(VDD)
-10V: J2.1 U5.28(VREFL)
DGND: C1.1 C4.2 C15.1 C16.1 C17.1 C18.1 C19.1 C20.1 C21.2 C22.1 C23.1 C24.1 C25.1 C26.2 C27.2 C28.2 C29.2 C30.1 C31.1 C32.1 C33.1 C34.1 C35.1 C36.1 C37.1 C38.1 C39.1 C40.1 C41.1 C42.1 C43.2 C48.2 C49.2 J1.2 J1.10 J2.3 J2.5 J2.7 J2.9 J2.19 J2.21 J2.30 J2.39 J2.40 J2.51 J2.52 J2.60 J2.61 J2.62 J2.63 J2.64 J2.65 J2.69 J2.70 P1.2 P1.10 Q1.3(E) R1.2 R15.1 RP1.7 RP2.4 U1.6(GND) U1.17(CLK0, LVDSCLK0p INPUT) U1.19(GND) U1.21(CLK2, LVDSCLK1p INPUT) U1.22(CLK3, LVDSCLK1n INPUT) U1.27(GND) U1.33(GND) U1.34(GND_PLL1) U1.36(GND_PLL1) U1.38(GNDA_PLL1) U1.39(GND) U1.49(GND) U1.56(GND) U1.61(GND) U1.68(GND) U1.78(GND) U1.80(GND) U1.85(MSEL0) U1.88(CLK7, LVDSCLK3n INPUT) U1.89(CLK6, LVDSCLK3p INPUT) U1.90(CLK5, LVDSCLK2n INPUT) U1.91(CLK4, LVDSCLK2p INPUT) U1.98(GND) U1.105(GND) U1.106(GND_PLL2) U1.108(GND_PLL2) U1.110(GNDA_PLL2) U1.111(GND) U1.117(GND) U1.123(GND) U1.128(GND) U1.130(GND) U1.140(GND) U3.2(NC) U4.10(GND) U5.4(VSS) U5.5(DGND) U6.2(K1) U6.3(K2) U7.2(K1) U7.3(K2) U8.2(K1) U8.3(K2) U10.3(GND) U11.1(SYNC) U11.3(GND) U11.6(-Sense) U12.4(GND) U17.4(GND) U18.4(GND) U19.2(Vi-)
VCC+5V: C4.1 C26.1 C27.1 J2.37 J2.66 J2.67 J2.68 R12.2 R14.2 R21.1 R22.1 R24.1 R25.1 U11.2(VI) U19.1(Vi+)
VCCINT: C15.2 C16.2 C17.2 C18.2 C19.2 C20.2 C21.1 C22.2 C23.2 C24.2 C25.2 U1.26(VCCINT) U1.35(VCCD_PLL1) U1.37(VCCA_PLL1) U1.50(VCCINT) U1.62(VCCINT) U1.81(VCCINT) U1.107(VCCD_PLL2) U1.109(VCCA_PLL2) U1.124(VCCINT) U1.131(VCCINT) U10.4(OUT)
A0: U1.100(IO, LVDS39n, DQ1R2) U5.22(A0)
A1: U1.99(IO, VREFB3N0) U5.21(A1)
ASDO: J1.9 U1.1(IO, (ASDO)) U4.15(ASDI)
CLK_25M: U1.18(CLK1, LVDSCLK0n INPUT) U3.3
CONF_DONE: J1.3 RP1.3 U1.83(CONF_DONE)
CS: U1.119(IO, LVDS34p, (DPCLK8/DQS0T)) U5.23(~CS~)
D_DRIVER: R23.2 U1.114(IO, LVDS36n)
DATA0: J1.7 U1.14(DATA0) U4.8(DATA)
DB0: U1.8(IO, LVDS8p, (DPCLK0/DQS0L)) U5.8(DB0(LSB))
DB1: U1.9(IO, LVDS8n) U5.9(DB1)
DB2: U1.24(IO, LVDS7p, (DPCLK1/DQS1L)) U5.10(DB2)
DB3: U1.25(IO, LVDS7n) U5.11(DB3)
DB4: U1.28(IO, VREFB1N1) U5.12(DB4)
DB5: U1.120(IO, VREFB2N0) U5.13(DB5)
DB6: U1.121(IO, LVDS33n) U5.14(DB6)
DB7: U1.122(IO, LVDS33p) U5.15(DB7)
DB8: U1.69(IO, LVDS58p) U5.16(DB8)
DB9: U1.70(IO, LVDS58n) U5.17(DB9)
DB10: U1.71(IO, LVDS57p) U5.18(DB10)
DB11: U1.72(IO, LVDS57n) U5.19(DB11(MSB))
DCLK: J1.1 U1.15(DCLK) U4.16(DCLK)
DO.DR+: J2.8 R21.2 R22.2 R24.2 R25.2
DO.DR-: J2.6 Q1.2(C)
DRAM_A0: U1.52(IO, LVDS70p, DQ1B4)
DRAM_A1: U1.53(IO, LVDS68p, DQ1B3)
DRAM_A2: U1.51(IO, VREFB4N1)
DRAM_A3: U1.55(IO, LVDS68n, DQ1B2)
DRAM_A4: U1.58(IO, LVDS67n, DQ1B0)
DRAM_A5: U1.60(IO, LVDS66n)
DRAM_A6: U1.57(IO, LVDS67p, DQ1B1)
DRAM_A7: U1.64(IO, LVDS60p, (DPCLK4/DQS0B))
DRAM_A8: U1.59(IO, LVDS66p)
DRAM_A9: U1.67(IO, LVDS59n)
DRAM_A10: U1.47(IO, LVDS74p, (DPCLK2/DQS1B))
DRAM_A11: U1.63(IO, VREFB4N0)
DRAM_A12: U1.65(IO, LVDS60n)
DRAM_BA0: U1.44(IO, LVDS75p, DQ1B6)
DRAM_BA1: U1.48(IO, LVDS74n)
DRAM_CKE: U1.32(IO, PLL1_OUTn)
DRAM_CLK: U1.31(IO, PLL1_OUTp)
DRAM_D0: U1.134(IO, LVDS23p, DQ1T4)
DRAM_D1: U1.135(IO, LVDS19n, DQ1T5)
DRAM_D2: U1.141(IO, LVDS17p, DQ1T8)
DRAM_D3: U1.142(IO, LVDS17n (DEV_CLRn))
DRAM_D4: U1.143(IO, LVDS16p, (DM1T/BWS#1T))
DRAM_D5: U1.144(IO, LVDS16n)
DRAM_D6: U1.3(IO, LVDS15p (CRC_ERROR))
DRAM_D7: U1.4(IO, LVDS15n (CLKUSR))
DRAM_D8: U1.136(IO, LVDS19p, (DPCLK10/DQS1T))
DRAM_D9: U1.139(IO, LVDS18p, DQ1T7)
DRAM_D10: U1.137(IO, LVDS18n, DQ1T6)
DRAM_D11: U1.133(IO, LVDS23n, DQ1T3)
DRAM_D12: U1.132(IO, VREFB2N1)
DRAM_D13: U1.125(IO, LVDS29n, DQ1T0)
DRAM_D14: U1.129(IO, LVDS26p, DQ1T2)
DRAM_D15: U1.126(IO, LVDS29p, DQ1T1)
DRAM_LDQM: U1.41(IO, LVDS77p, (DM1B/BWS#1B))
DRAM_NCAS: U1.43(IO, LVDS76n, DQ1B7)
DRAM_NCS: U1.45(IO, LVDS75n, DQ1B5)
DRAM_NRAS: U1.42(IO, LVDS76p, DQ1B8)
DRAM_NWE: U1.40(IO, LVDS77n (DEV_OE))
DRAM_UDQM: U1.7(IO, VREFB1N0)
DVS+3V3: C1.2 C28.1 C29.1 C30.2 C31.2 C32.2 C33.2 C34.2 C35.2 C36.2 C37.2 C38.2 C39.2 C40.2 C41.2 C42.2 C43.1 C48.1 C49.1 J1.4 P1.4 P1.6 R2.2 R11.1 R13.1 RP1.5 RP1.6 RP1.8 RP2.1 RP2.3 U1.5(VCCIO1) U1.23(VCCIO1) U1.29(VCCIO1) U1.46(VCCIO4) U1.54(VCCIO4) U1.66(VCCIO4) U1.77(VCCIO3) U1.95(VCCIO3) U1.102(VCCIO3) U1.116(VCCIO2) U1.127(VCCIO2) U1.138(VCCIO2) U3.4 U4.1(VCC) U4.2(VCC) U4.9(VCC) U10.1(EN) U10.2(IN) U11.4(Vo) U11.5(+Sense) U12.1(VCC) U17.1(VCC) U18.1(VCC)
ISOVS+: C2.1 C3.1 C5.1 C6.1 C7.1 R3.1 R4.1 R5.1 R6.1 R7.1 R8.1 U6.8(VCC) U7.8(VCC) U8.8(VCC) U19.6(Vo+)
ISOVS-: C2.2 C3.2 C5.2 C6.2 C7.2 U6.5(GND) U7.5(GND) U8.5(GND) U19.4(Vo-)
LASER_CTRL1: RN1.3 U1.79(IO, VREFB3N1)
LASER_CTRL2: RN1.4 U1.75(IO, LVDS54n (INIT_DONE))
LASER_CTRL3: RN1.1 U1.76(IO, LVDS54p (nCEO))
LASER_CTRL4: RN1.2 U1.74(IO, LVDS56p, DQ1R8)
LASER_CTRL5: R9.1 U1.87(IO, LVDS48p, (DPCLK6/DQS1R))
LASER_CTRL6: R10.1 U1.73(IO, LVDS56n, (DM1R/BWS#1R))
LASER_P1: J2.34 R3.2 U6.7(OUT1)
LASER_P2: J2.33 R4.2 U6.6(OUT2)
LASER_P3: J2.32 R5.2 U7.7(OUT1)
LASER_P4: J2.31 R6.2 U7.6(OUT2)
LASER_P5: J2.18 R7.2 U8.7(OUT1)
LASER_P6: J2.20 R8.2 U8.6(OUT2)
LDAC: U1.112(IO, LVDS37n) U5.7(~LDAC~)
NCE: J1.6 RP1.2 U1.16(nCE)
NCONFIG: J1.5 RP1.1 U1.20(nCONFIG)
NCSO: J1.8 U1.2(IO, (nCSO)) U4.7(nCS)
NSTATUS: RP1.4 U1.82(nSTATUS)
R/W: U1.101(IO, LVDS39p, DQ1R1) U5.20(R/~W~)
RESET: U1.30(IO) U5.6(~RESET~)
RS422_R1+: J2.22 R16.2 U12.8(A)
RS422_R1-: J2.23 R16.1 U12.7(B)
RS422_R4+: J2.24 R26.2 U17.8(A)
RS422_R4-: J2.25 R26.1 U17.7(B)
RS422_R5+: R27.2 U18.8(A)
RS422_R5-: R27.1 U18.7(B)
RS422_T1+: J2.28 U12.5(Y)
RS422_T1-: J2.29 U12.6(Z)
RS422_T4+: J2.27 U17.5(Y)
RS422_T4-: J2.26 U17.6(Z)
RS422_T5+: U18.5(Y)
RS422_T5-: U18.6(Z)
TCK: P1.1 RP2.5 U1.12(TCK)
TDI: P1.9 RP2.8 U1.13(TDI)
TDO: P1.3 U1.10(TDO)
TMS: P1.5 RP2.6 U1.11(TMS)
UART1.RXD: U1.103(IO, PLL2_OUTp, DQ1R0) U12.2(RO)
UART1.TXD: U1.92(IO, LVDS47n, DQ1R6) U12.3(DI)
UART2.RXD: U1.97(IO, LVDS45n, DQ1R3)
UART2.TXD: U1.115(IO, LVDS36p)
UART3.RXD: U1.94(IO, LVDS46n, DQ1R5)
UART3.TXD: U1.118(IO, LVDS34n)
UART4.RXD: U1.104(IO, PLL2_OUTn) U17.2(RO)
UART4.TXD: U1.86(IO, LVDS48n, DQ1R7) U17.3(DI)
UART5.RXD: U18.2(RO)
UART5.TXD: U18.3(DI)
VOUTA: J2.2 U5.3(VOUTA)
VOUTB: J2.4 U5.2(VOUTB)
Net-(Q1-1): Q1.1(B) R23.1
Net-(R1-1): R1.1 R2.1 U1.84(MSEL1)
Net-(R9-2): R9.2 U8.1(A1)
Net-(R10-2): R10.2 U8.4(A2)
Net-(R11-2): R11.2 U10.5(EF)
Net-(R12-1): R12.1 U11.9(Track)
Net-(R13-2): R13.2 U11.8(TT)
Net-(R14-1): R14.1 U11.10(INH/UVLO)
Net-(R15-2): R15.2 U11.7(VoAdj)
Net-(RN1-5): RN1.5 U6.4(A2)
Net-(RN1-6): RN1.6 U6.1(A1)
Net-(RN1-7): RN1.7 U7.4(A2)
Net-(RN1-8): RN1.8 U7.1(A1)
Net-(TP1-1): TP1.1 U5.27(VOUTC)
Net-(TP2-1): TP2.1 U5.26(VOUTD)

Not connected (* = marked no-connect by the designer): J2 10 11 12 13 14 15 16 17 38 41 42 43 44 45 46 47 48 49 50 53 54 55 56 57 58 59; P1 7* 8*; RP2 2* 7*; U1 93(IO, LVDS47p, (DPCLK7/DQS0R)) 96(IO, LVDS46p, DQ1R4) 113(IO, LVDS37p); U3 1*; U4 3(NC)* 4(NC)* 5(NC)* 6(NC)* 11(NC)* 12(NC)* 13(NC)* 14(NC)*; U5 24(VLOGIC)*
